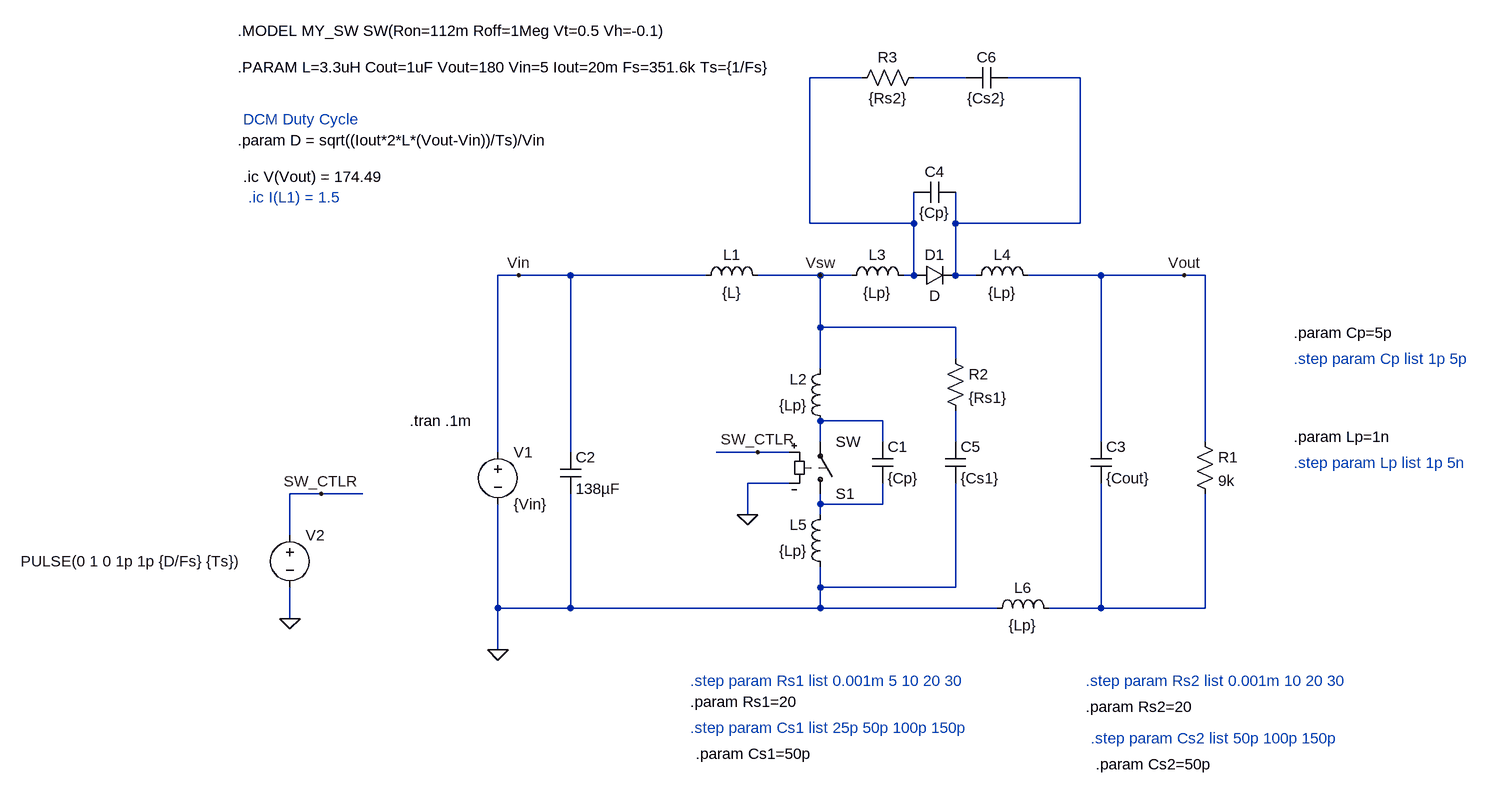
[diagram p0: schematic 180V_DCM_boost_parasitics_snub.asc]
180V_DCM_boost_parasitics_snub.asc, the LTspice schematic file:
Version 4
SHEET 1 1576 680
WIRE 640 -448 560 -448
WIRE 800 -448 720 -448
WIRE 976 -448 864 -448
WIRE 560 -224 560 -448
WIRE 720 -224 720 -272
WIRE 720 -224 560 -224
WIRE 784 -224 784 -272
WIRE 976 -224 976 -448
WIRE 976 -224 784 -224
WIRE 112 -144 80 -144
WIRE 192 -144 112 -144
WIRE 400 -144 192 -144
WIRE 576 -144 480 -144
WIRE 624 -144 576 -144
WIRE 720 -144 720 -224
WIRE 720 -144 704 -144
WIRE 784 -144 784 -224
WIRE 816 -144 784 -144
WIRE 1008 -144 896 -144
WIRE 1136 -144 1008 -144
WIRE 1168 -144 1136 -144
WIRE 576 -64 576 -144
WIRE 784 -64 576 -64
WIRE 784 -16 784 -64
WIRE 576 0 576 -64
WIRE 672 80 576 80
WIRE 576 112 576 80
WIRE 672 112 672 80
WIRE 784 112 784 64
WIRE 1008 112 1008 -144
WIRE 1168 112 1168 -144
WIRE 80 128 80 -144
WIRE 192 128 192 -144
WIRE 480 128 416 128
WIRE 528 128 480 128
WIRE 528 176 464 176
WIRE -192 192 -240 192
WIRE -128 192 -192 192
WIRE 576 208 576 192
WIRE 672 208 672 176
WIRE 672 208 576 208
WIRE 464 224 464 176
WIRE 576 224 576 208
WIRE -240 256 -240 192
WIRE 576 336 576 304
WIRE 784 336 784 176
WIRE 784 336 576 336
WIRE 80 368 80 208
WIRE 192 368 192 192
WIRE 192 368 80 368
WIRE 576 368 576 336
WIRE 576 368 192 368
WIRE 848 368 576 368
WIRE 1008 368 1008 176
WIRE 1008 368 928 368
WIRE 1168 368 1168 192
WIRE 1168 368 1008 368
WIRE -240 384 -240 336
WIRE 80 432 80 368
FLAG 80 432 0
FLAG -240 384 0
FLAG 464 224 0
FLAG 480 128 SW_CTLR
FLAG -192 192 SW_CTLR
FLAG 1136 -144 Vout
FLAG 112 -144 Vin
FLAG 576 -144 Vsw
SYMBOL Voltage 80 112 R0
SYMATTR InstName V1
SYMATTR Value {Vin}
SYMATTR SpiceLine Rser=10m
SYMBOL Voltage -240 240 R0
WINDOW 3 -414 56 Left 2
SYMATTR Value PULSE(0 1 0 1p 1p {D/Fs} {Ts})
SYMATTR InstName V2
SYMBOL Cap 176 128 R0
SYMATTR InstName C2
SYMATTR Value 138µF
SYMBOL Cap 992 112 R0
SYMATTR InstName C3
SYMATTR Value {Cout}
SYMBOL ind 384 -128 R270
WINDOW 0 32 56 VTop 2
WINDOW 3 5 56 VBottom 2
SYMATTR InstName L1
SYMATTR Value {L}
SYMBOL Diode 720 -128 R270
WINDOW 0 32 32 VTop 2
WINDOW 3 0 32 VBottom 2
SYMATTR InstName D1
SYMBOL sw 576 208 M180
SYMATTR InstName S1
SYMATTR SpiceModel MY_SW
SYMBOL Res 1152 96 R0
SYMATTR InstName R1
SYMATTR Value 9k
SYMBOL ind 592 96 R180
WINDOW 0 36 80 Left 2
WINDOW 3 36 40 Left 2
SYMATTR InstName L2
SYMATTR Value {Lp}
SYMBOL ind 608 -128 R270
WINDOW 0 32 56 VTop 2
WINDOW 3 5 56 VBottom 2
SYMATTR InstName L3
SYMATTR Value {Lp}
SYMBOL ind 800 -128 R270
WINDOW 0 32 56 VTop 2
WINDOW 3 5 56 VBottom 2
SYMATTR InstName L4
SYMATTR Value {Lp}
SYMBOL ind 592 320 R180
WINDOW 0 36 80 Left 2
WINDOW 3 36 40 Left 2
SYMATTR InstName L5
SYMATTR Value {Lp}
SYMBOL ind 832 384 R270
WINDOW 0 32 56 VTop 2
WINDOW 3 5 56 VBottom 2
SYMATTR InstName L6
SYMATTR Value {Lp}
SYMBOL Cap 656 112 R0
SYMATTR InstName C1
SYMATTR Value {Cp}
SYMBOL Cap 720 -256 R270
WINDOW 0 32 32 VTop 2
WINDOW 3 0 32 VBottom 2
SYMATTR InstName C4
SYMATTR Value {Cp}
SYMBOL Cap 768 112 R0
SYMATTR InstName C5
SYMATTR Value {Cs1}
SYMBOL Res 768 -32 R0
SYMATTR InstName R2
SYMATTR Value {Rs1}
SYMBOL Res 736 -464 R90
WINDOW 0 0 56 VBottom 2
WINDOW 3 32 56 VTop 2
SYMATTR InstName R3
SYMATTR Value {Rs2}
SYMBOL Cap 864 -464 R90
WINDOW 0 0 32 VBottom 2
WINDOW 3 32 32 VTop 2
SYMATTR InstName C6
SYMATTR Value {Cs2}
TEXT -320 -520 Left 2 !.MODEL MY_SW SW(Ron=112m Roff=1Meg Vt=0.5 Vh=-0.1)
TEXT -320 -464 Left 2 !.PARAM L=3.3uH Cout=1uF Vout=180 Vin=5 Iout=20m Fs=351.6k Ts={1/Fs}
TEXT -56 80 Left 2 !.tran .1m
TEXT -320 -352 Left 2 !.param D = sqrt((Iout*2*L*(Vout-Vin))/Ts)/Vin
TEXT -312 -384 Left 2 ;DCM Duty Cycle
TEXT -312 -296 Left 2 !.ic V(Vout) = 174.49
TEXT -304 -264 Left 2 ;.ic I(L1) = 1.5
TEXT 376 512 Left 2 !.param Rs1=20
TEXT 984 480 Left 2 ;.step param Rs2 list 0.001m 10 20 30
TEXT 992 568 Left 2 ;.step param Cs2 list 50p 100p 150p
TEXT 984 520 Left 2 !.param Rs2=20
TEXT 1000 608 Left 2 !.param Cs2=50p
TEXT 376 480 Left 2 ;.step param Rs1 list 0.001m 5 10 20 30
TEXT 384 592 Left 2 !.param Cs1=50p
TEXT 376 552 Left 2 ;.step param Cs1 list 25p 50p 100p 150p
TEXT 1304 -56 Left 2 !.param Cp=5p
TEXT 1304 -16 Left 2 ;.step param Cp list 1p 5p
TEXT 1304 104 Left 2 !.param Lp=1n
TEXT 1304 144 Left 2 ;.step param Lp list 1p 5n

The netlist it stands for:
* 180V_DCM_boost_parasitics_snub.asc
V1 Vin 0 {Vin} Rser=10m
V2 SW_CTLR 0 PULSE(0 1 0 1p 1p {D/Fs} {Ts})
C2 Vin 0 138µF
C3 Vout N007 {Cout}
L1 Vin Vsw {L}
D1 N001 N003 D
S1 N006 N004 SW_CTLR 0 MY_SW SW
R1 Vout N007 9k
L2 N004 Vsw {Lp}
L3 Vsw N001 {Lp}
L4 N003 Vout {Lp}
L5 0 N006 {Lp}
L6 0 N007 {Lp}
C1 N004 N006 {Cp}
C4 N001 N003 {Cp}
C5 N005 0 {Cs1}
R2 Vsw N005 {Rs1}
R3 N002 N001 {Rs2}
C6 N003 N002 {Cs2}
.model D D
.lib standard.dio
.MODEL MY_SW SW(Ron=112m Roff=1Meg Vt=0.5 Vh=-0.1)
.PARAM L=3.3uH Cout=1uF Vout=180 Vin=5 Iout=20m Fs=351.6k Ts={1/Fs}
.tran .1m
.param D = sqrt((Iout*2*L*(Vout-Vin))/Ts)/Vin
* DCM Duty Cycle
.ic V(Vout) = 174.49
* .ic I(L1) = 1.5
.param Rs1=20
* .step param Rs2 list 0.001m 10 20 30
* .step param Cs2 list 50p 100p 150p
.param Rs2=20
.param Cs2=50p
* .step param Rs1 list 0.001m 5 10 20 30
.param Cs1=50p
* .step param Cs1 list 25p 50p 100p 150p
.param Cp=5p
* .step param Cp list 1p 5p
.param Lp=1n
* .step param Lp list 1p 5n
.backanno
.end